# EAGLE design MineSweepers2019-Board (EAGLE 9.3.0)
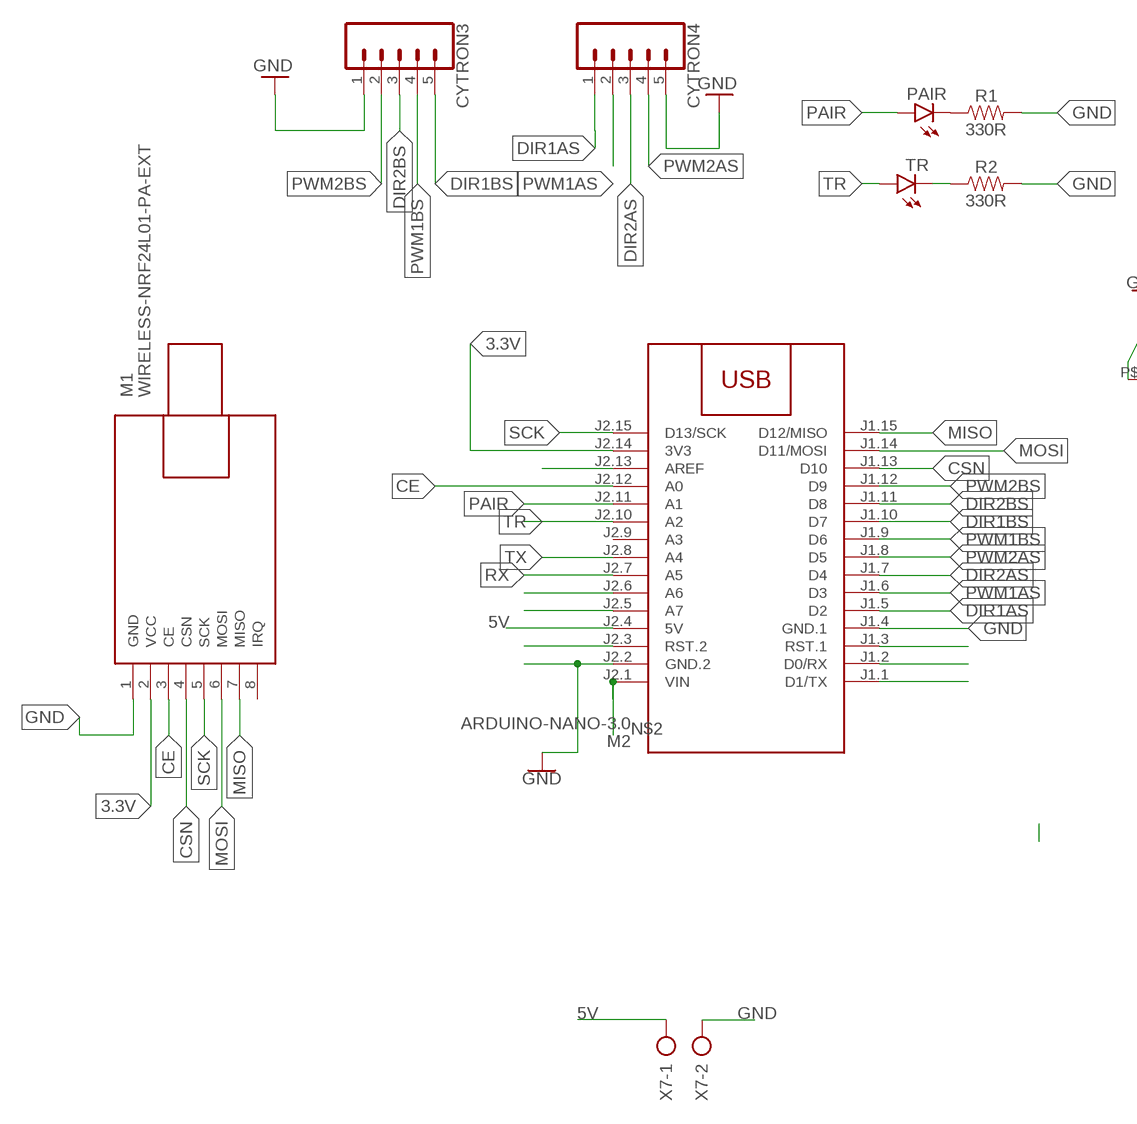
[diagram p0: schematic, sheet 1, part 1 of 2]
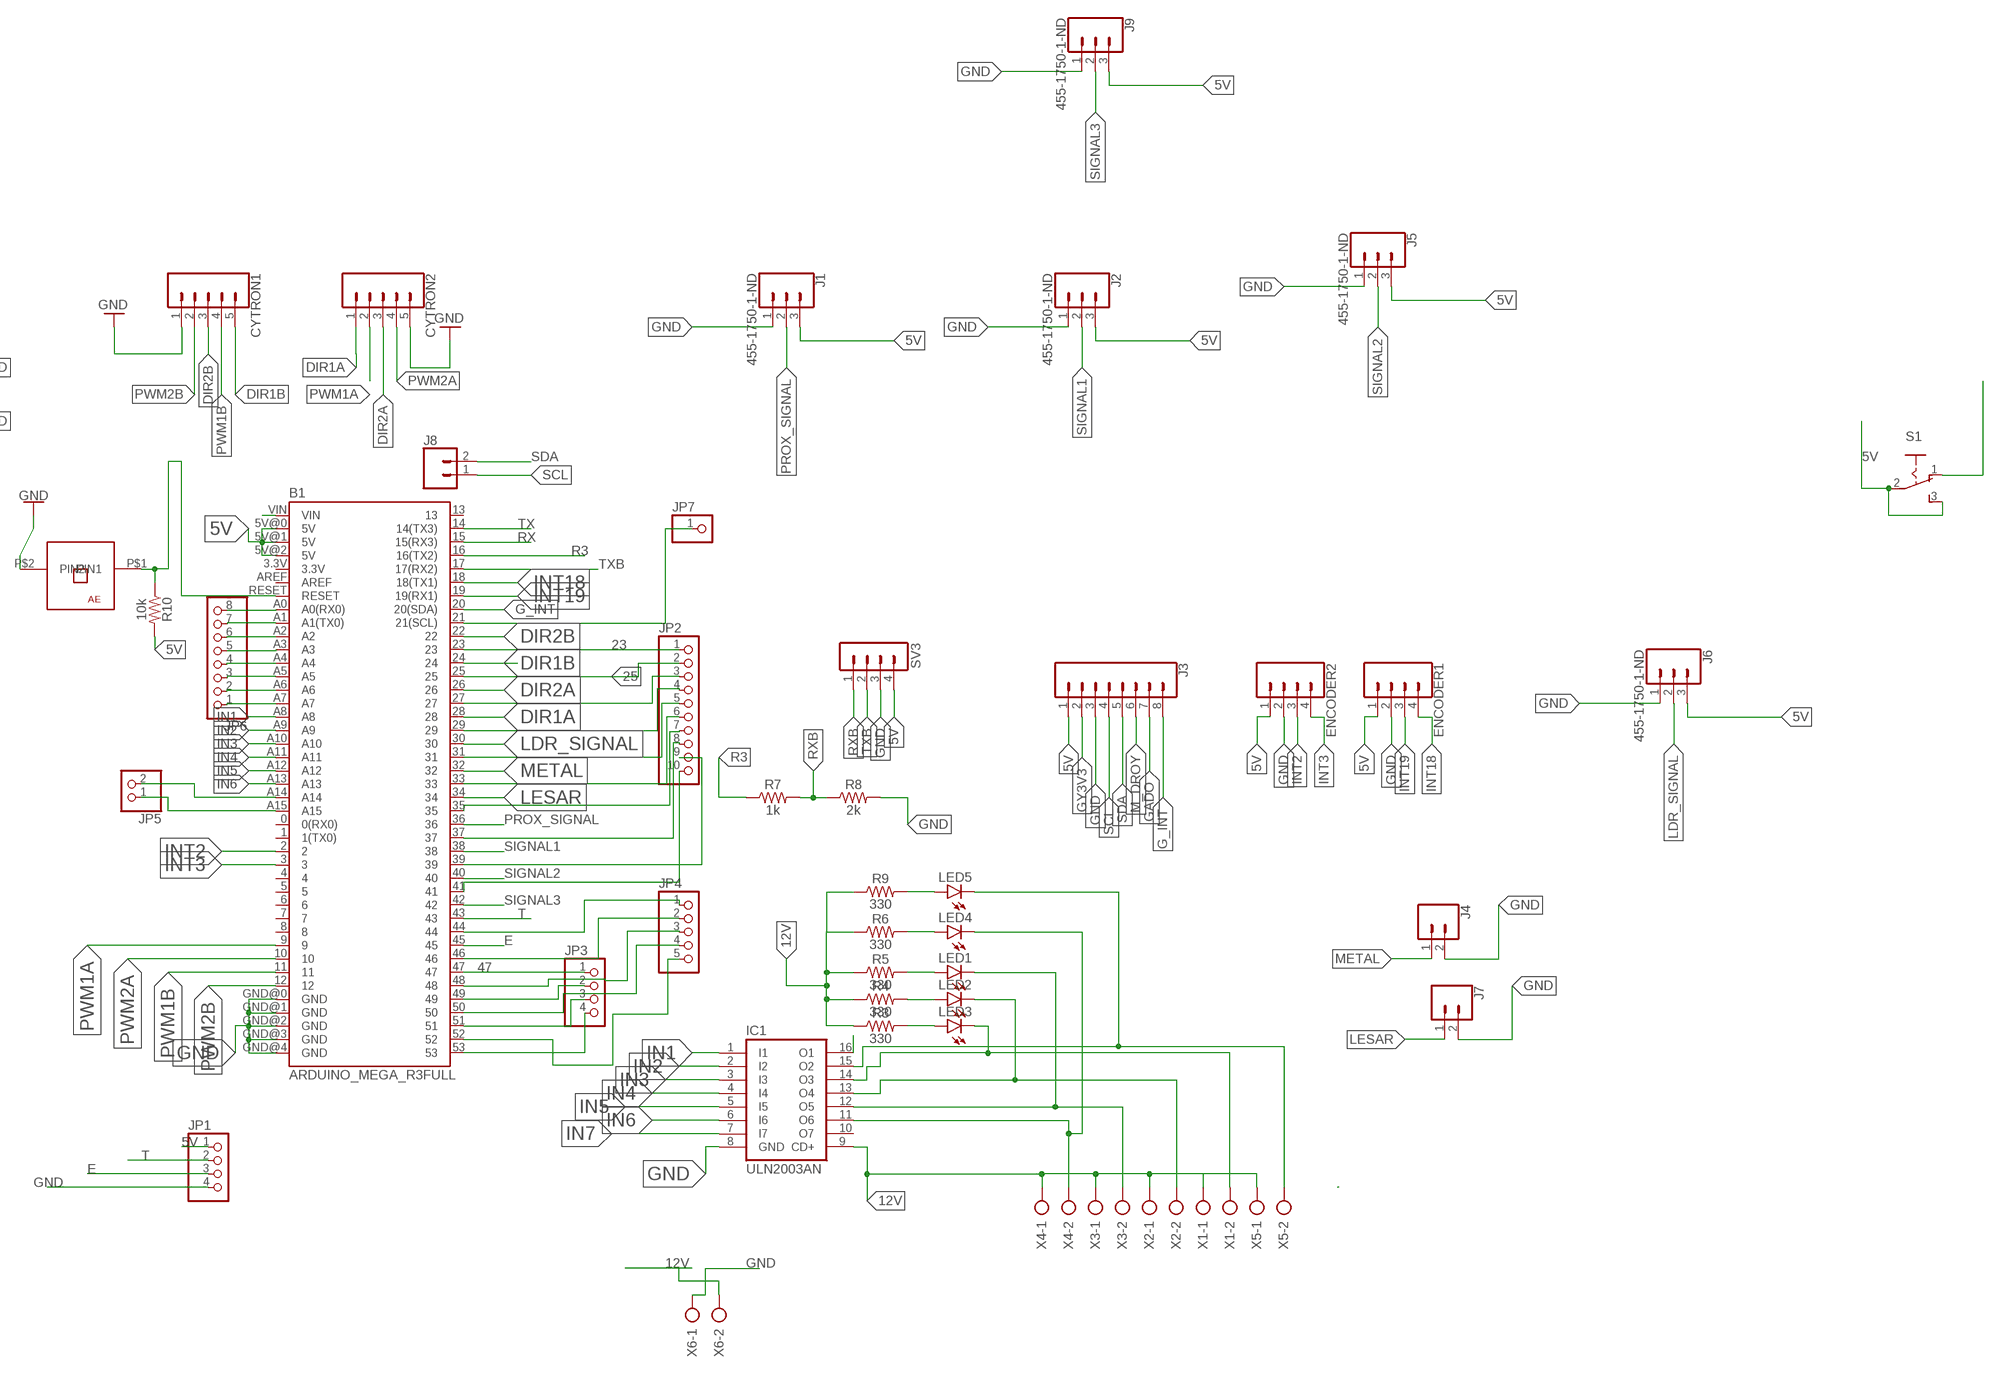
[diagram p1: schematic, sheet 1, part 2 of 2]

## Parts
B1  ARDUINO_MEGA_R3FULL  [ARDUINO_MEGA]
CYTRON1  CONN_05  [1X05]
CYTRON2  CONN_05  [1X05]
CYTRON3  CONN_05  [1X05]
CYTRON4  CONN_05  [1X05]
ENCODER1  CONN_04  [1X04]
ENCODER2  CONN_04  [1X04]
IC1  ULN2003AN  [DIL16]
J1  455-1750-1-ND  CONN_03  [1X03]
J2  455-1750-1-ND  CONN_03  [1X03]
J3  CONN_08"  [1X08]
J4  CONN_02  [1X02]
J5  455-1750-1-ND  CONN_03  [1X03]
J6  455-1750-1-ND  CONN_03  [1X03]
J7  CONN_02  [1X02]
J8  CONN_02  [1X02]
J9  455-1750-1-ND  CONN_03  [1X03]
JP1  PINHD-1X4  [1X04]
JP2  PINHD-1X10  [1X10]
JP3  PINHD-1X4  [1X04]
JP4  PINHD-1X5  [1X05]
JP5  PINHD-1X2  [1X02]
JP6  PINHD-1X8  [1X08]
JP7  PINHD-1X1  [1X01]
LED1  LED3MM  [LED3MM]
LED2  LED3MM  [LED3MM]
LED3  LED3MM  [LED3MM]
LED4  LED3MM  [LED3MM]
LED5  LED3MM  [LED3MM]
M1  WIRELESS-NRF24L01-PA-EXT  [WIRELESS-NRF24L01-PA-EXT]
M2  ARDUINO-NANO-3.0  [ARDUINO-NANO-3.0]
PAIR  LED3MM  [LED3MM]
R1  330R  10MOHM-HORIZ-1/4W-5%  [AXIAL-0.3]
R2  330R  10MOHM-HORIZ-1/4W-5%  [AXIAL-0.3]
R3  330  10MOHM-HORIZ-1/4W-5%  [AXIAL-0.3]
R4  330  10MOHM-HORIZ-1/4W-5%  [AXIAL-0.3]
R5  330  10MOHM-HORIZ-1/4W-5%  [AXIAL-0.3]
R6  330  10MOHM-HORIZ-1/4W-5%  [AXIAL-0.3]
R7  1k  10MOHM-HORIZ-1/4W-5%  [AXIAL-0.3]
R8  2k  10MOHM-HORIZ-1/4W-5%  [AXIAL-0.3]
R9  330  10MOHM-HORIZ-1/4W-5%  [AXIAL-0.3]
R10  10k  10MOHM-HORIZ-1/4W-5%  [AXIAL-0.3]
S1  255SB  [255SB]
SV3  MA04-1  [MA04-1]
TR  LED3MM  [LED3MM]
U$1  PUSHBUTTON-AE  [PUSHBUTTON-AE]
X1  AK500/2-H  [AK500/2-H]
X2  AK500/2-H  [AK500/2-H]
X3  AK500/2-H  [AK500/2-H]
X4  AK500/2-H  [AK500/2-H]
X5  AK500/2-H  [AK500/2-H]
X6  AK500/2-H  [AK500/2-H]
X7  AK500/2-H  [AK500/2-H]

## Nets
3.3V: M1.2(VCC) M2.J2.14(3V3)
5V: B1.5V@0(5V) B1.5V@1(5V) B1.5V@2(5V) ENCODER1.1 ENCODER2.1 J1.3 J2.3 J3.1 J5.3 J6.3 J9.3 JP1.1 M2.J2.4(5V) R10.P$2 S1.2(P) S1.3(S) SV3.4 X7.1
12V: IC1.9(CD+) R3.P$1 R4.P$1 R5.P$1 R6.P$1 R9.P$1 X1.1 X2.1 X3.1 X4.1 X5.1 X6.2
23: B1.23 JP2.1
25: B1.25 JP2.2
47: B1.47 JP3.1
CE: M1.3(CE) M2.J2.12(A0)
CSN: M1.4(CSN) M2.J1.13(D10)
DIR1A: B1.28 CYTRON2.1
DIR1AS: CYTRON4.1 M2.J1.5(D2)
DIR1B: B1.24 CYTRON1.5
DIR1BS: CYTRON3.5 M2.J1.10(D7)
DIR2A: B1.26 CYTRON2.3
DIR2AS: CYTRON4.3 M2.J1.7(D4)
DIR2B: B1.22 CYTRON1.3
DIR2BS: CYTRON3.3 M2.J1.11(D8)
E: B1.45 JP1.3
G_INT: B1.20(20(SDA)) J3.8
GADO: J3.7
GND: B1.GND@0(GND) B1.GND@1(GND) B1.GND@2(GND) B1.GND@3(GND) B1.GND@4(GND) CYTRON1.1 CYTRON2.5 CYTRON3.1 CYTRON4.5 ENCODER1.2 ENCODER2.2 IC1.8(GND) J1.1 J2.1 J3.3 J4.2 J5.1 J6.1 J7.2 J9.1 JP1.4 M1.1(GND) M2.J1.4(GND.1) M2.J2.2(GND.2) R1.P$2 R2.P$2 R8.P$2 SV3.3 U$1.P$2(PIN2) X6.1 X7.2
GY3V3: J3.2
IN1: B1.A8 IC1.1(I1)
IN2: B1.A9 IC1.2(I2)
IN3: B1.A10 IC1.3(I3)
IN4: B1.A11 IC1.4(I4)
IN5: B1.A12 IC1.5(I5)
IN6: B1.A13 IC1.6(I6)
IN7: IC1.7(I7)
INT2: B1.2 ENCODER2.3
INT3: B1.3 ENCODER2.4
INT18: B1.18(18(TX1)) ENCODER1.4
INT19: B1.19(19(RX1)) ENCODER1.3
LDR_SIGNAL: B1.30 J6.2
LESAR: B1.34 J7.1
M_DROY: J3.6
METAL: B1.32 J4.1
MISO: M1.7(MISO) M2.J1.15(D12/MISO)
MOSI: M1.6(MOSI) M2.J1.14(D11/MOSI)
N$1: M2.J1.3(RST.1)
N$2: M2.J2.1(VIN)
N$3: LED5.A R9.P$2
N$4: S1.1(O)
N$5: PAIR.K(C) R1.P$1
N$6: M2.J2.13(AREF)
N$7: R2.P$1 TR.K(C)
N$10: B1.27 JP2.3
N$11: IC1.13(O4) LED2.K(C) X2.2
N$12: IC1.14(O3) LED3.K(C) X1.2
N$13: M2.J2.6(A6)
N$14: M2.J2.5(A7)
N$15: IC1.12(O5) LED1.K(C) X3.2
N$16: M2.J2.3(RST.2)
N$17: B1.29 JP2.4
N$18: B1.31 JP2.5
N$19: B1.33 JP2.6
N$20: B1.35 JP2.7
N$21: LED3.A R3.P$2
N$22: LED2.A R4.P$2
N$23: B1.37 JP2.8
N$24: LED1.A R5.P$2
N$25: M2.J1.2(D0/RX)
N$26: M2.J1.1(D1/TX)
N$27: B1.39 JP2.9
N$28: B1.41 JP2.10
N$29: B1.49 JP3.2
N$30: B1.51 JP3.3
N$31: LED4.A R6.P$2
N$32: B1.53 JP3.4
N$33: B1.44 JP4.1
N$34: B1.46 JP4.2
N$35: B1.48 JP4.3
N$36: B1.50 JP4.4
N$37: B1.52 JP4.5
N$38: B1.A1(A1(TX0)) JP6.7
N$39: B1.A2 JP6.6
N$40: B1.A3 JP6.5
N$41: B1.A4 JP6.4
N$42: B1.A5 JP6.3
N$43: B1.A6 JP6.2
N$44: B1.A7 JP6.1
N$45: B1.A0(A0(RX0)) JP6.8
N$46: B1.A14 JP5.2
N$47: B1.A15 JP5.1
N$48: B1.21(21(SCL)) JP7.1
N$50: B1.RESET R10.P$1 U$1.P$1(PIN1)
O1: IC1.15(O2) LED5.K(C) X5.2
O2: IC1.16(O1)
O6: IC1.11(O6) LED4.K(C) X4.2
PAIR: M2.J2.11(A1) PAIR.A
PROX_SIGNAL: B1.36 J1.2
PWM1A: B1.9 CYTRON2.2
PWM1AS: CYTRON4.2 M2.J1.6(D3)
PWM1B: B1.11 CYTRON1.4
PWM1BS: CYTRON3.4 M2.J1.9(D6)
PWM2A: B1.10 CYTRON2.4
PWM2AS: CYTRON4.4 M2.J1.8(D5)
PWM2B: B1.12 CYTRON1.2
PWM2BS: CYTRON3.2 M2.J1.12(D9)
R3: B1.16(16(TX2)) R7.P$1
RX: B1.15(15(RX3)) M2.J2.7(A5)
RXB: R7.P$2 R8.P$1 SV3.1
SCK: M1.5(SCK) M2.J2.15(D13/SCK)
SCL: J3.4 J8.1
SDA: J3.5 J8.2
SIGNAL1: B1.38 J2.2
SIGNAL2: B1.40 J5.2
SIGNAL3: B1.42 J9.2
T: B1.43 JP1.2
TR: M2.J2.10(A2) TR.A
TX: B1.14(14(TX3)) M2.J2.8(A4)
TXB: B1.17(17(RX2)) SV3.2
VIN: B1.VIN
Unconnected: B1.0(0(RX0)) B1.1(1(TX0)) B1.3.3V B1.4 B1.5 B1.6 B1.7 B1.8 B1.13 B1.AREF IC1.10(O7) M1.8(IRQ) M2.J2.9(A3)

## Library data of the parts
B1 = SparkFun-Boards:ARDUINO_MEGA_R3: Arduino Mega R3 ATmega2560 R3 compatible footprint. SparkFun Products: Arduino Mega 2560 R3 <https://www.sparkfun.com/products/11061>
CYTRON1-CYTRON4 = SparkFun-Connectors:CONN_05: Multi connection point. Often used as Generic Header-pin footprint for 0.1 inch spaced/style header connections On any of the 0.1 inch spaced packages, you can populate with these: Break Away Headers - Straight <https://www.sparkfun.com/products/116> (PRT-00116) Break Away Male Headers - Right Angle <https://www.sparkfun.com/products/553> (PRT-00553) Female Headers <https://www.sparkfun.com/products/115> (PRT-00115) Break Away Headers - Machine Pin <https://www.sparkfun.com/products/117> (PRT-00117) Break Away Female Headers - Swiss Machine Pin <https://www.sparkfun.com/products/743> (PRT-00743) For SCREWTERMINALS and SPRING TERMINALS visit here: Screw Terimnals on SparkFun.com <https://www.sparkfun.com/search/results?term=Screw+Terminals> (5mm/3.5mm/2.54mm spacing) This device is also useful as a general connection point to wire up your design to another part of your project. Our various solder wires solder well into these plated through hole pads. Hook-Up Wire - Assortment (Stranded, 22 AWG) <https://www.sparkfun.com/products/11375> (PRT-11375) Hook-Up Wire - Assortment (Solid Core, 22 AWG) <https://www.sparkfun.com/products/11367> (PRT-11367) View the entire wire category on our website here <https://www.sparkfun.com/categories/141> Special notes: Molex polarized connector foot print use with SKU : PRT-08231 with associated crimp pins and housings. 1MM SMD Version SKU: PRT-10208
ENCODER1 ENCODER2 = SparkFun-Connectors:CONN_04: Multi connection point. Often used as Generic Header-pin footprint for 0.1 inch spaced/style header connections On any of the 0.1 inch spaced packages, you can populate with these: Break Away Headers - Straight <https://www.sparkfun.com/products/116> (PRT-00116) Break Away Male Headers - Right Angle <https://www.sparkfun.com/products/553> (PRT-00553) Female Headers <https://www.sparkfun.com/products/115> (PRT-00115) Break Away Headers - Machine Pin <https://www.sparkfun.com/products/117> (PRT-00117) Break Away Female Headers - Swiss Machine Pin <https://www.sparkfun.com/products/743> (PRT-00743) For SCREWTERMINALS and SPRING TERMINALS visit here: Screw Terimnals on SparkFun.com <https://www.sparkfun.com/search/results?term=Screw+Terminals> (5mm/3.5mm/2.54mm spacing) This device is also useful as a general connection point to wire up your design to another part of your project. Our various solder wires solder well into these plated through hole pads. Hook-Up Wire - Assortment (Stranded, 22 AWG) <https://www.sparkfun.com/products/11375> (PRT-11375) Hook-Up Wire - Assortment (Solid Core, 22 AWG) <https://www.sparkfun.com/products/11367> (PRT-11367) View the entire wire category on our website here <https://www.sparkfun.com/categories/141> Special notes: Molex polarized connector foot print use with SKU : PRT-08231 with associated crimp pins and housings. 1MM SMD Version SKU: PRT-10208; PROD_ID: CONN-09696
IC1 = uln-udn:ULN2003A: DRIVER ARRAY
J1 J2 J5 J6 J9 = SparkFun-Connectors:CONN_03: Multi connection point. Often used as Generic Header-pin footprint for 0.1 inch spaced/style header connections On any of the 0.1 inch spaced packages, you can populate with these: Break Away Headers - Straight <https://www.sparkfun.com/products/116> (PRT-00116) Break Away Male Headers - Right Angle <https://www.sparkfun.com/products/553> (PRT-00553) Female Headers <https://www.sparkfun.com/products/115> (PRT-00115) Break Away Headers - Machine Pin <https://www.sparkfun.com/products/117> (PRT-00117) Break Away Female Headers - Swiss Machine Pin <https://www.sparkfun.com/products/743> (PRT-00743) Stackable Header - 3 Pin (Female, 0.1") <https://www.sparkfun.com/products/13875> (PRT-13875) For SCREWTERMINALS and SPRING TERMINALS visit here: Screw Terimnals on SparkFun.com <https://www.sparkfun.com/search/results?term=Screw+Terminals> (5mm/3.5mm/2.54mm spacing) This device is also useful as a general connection point to wire up your design to another part of your project. Our various solder wires solder well into these plated through hole pads. Hook-Up Wire - Assortment (Stranded, 22 AWG) <https://www.sparkfun.com/products/11375> (PRT-11375) Hook-Up Wire - Assortment (Solid Core, 22 AWG) <https://www.sparkfun.com/products/11367> (PRT-11367) View the entire wire category on our website here <https://www.sparkfun.com/categories/141> Special notes: Molex polarized connector foot print use with SKU : PRT-08232 with associated crimp pins and housings.; PROD_ID: XXX-00000
J3 = SparkFun-Connectors:CONN_08: Multi connection point. Often used as Generic Header-pin footprint for 0.1 inch spaced/style header connections On any of the 0.1 inch spaced packages, you can populate with these: Break Away Headers - Straight <https://www.sparkfun.com/products/116> (PRT-00116) Break Away Male Headers - Right Angle <https://www.sparkfun.com/products/553> (PRT-00553) Female Headers <https://www.sparkfun.com/products/115> (PRT-00115) Break Away Headers - Machine Pin <https://www.sparkfun.com/products/117> (PRT-00117) Break Away Female Headers - Swiss Machine Pin <https://www.sparkfun.com/products/743> (PRT-00743) Arduino Stackable Header - 8 Pin <https://www.sparkfun.com/products/9279> (PRT-09279) For SCREWTERMINALS and SPRING TERMINALS visit here: Screw Terimnals on SparkFun.com <https://www.sparkfun.com/search/results?term=Screw+Terminals> (5mm/3.5mm/2.54mm spacing) This device is also useful as a general connection point to wire up your design to another part of your project. Our various solder wires solder well into these plated through hole pads. Hook-Up Wire - Assortment (Stranded, 22 AWG) <https://www.sparkfun.com/products/11375> (PRT-11375) Hook-Up Wire - Assortment (Solid Core, 22 AWG) <https://www.sparkfun.com/products/11367> (PRT-11367) View the entire wire category on our website here <https://www.sparkfun.com/categories/141> Special notes: Molex polarized connector foot print use with SKU : PRT-08231 with associated crimp pins and housings. 1MM SMD Version SKU: PRT-10208 NOTES ON THE VARIANTS LOCK and LOCK_LONGPADS... This footprint was designed to help hold the alignment of a through-hole component (i.e. 6-pin header) while soldering it into place. You may notice that each hole has been shifted either up or down by 0.005 of an inch from it's more standard position (which is a perfectly straight line). This slight alteration caused the pins (the squares in the middle) to touch the edges of the holes. Because they are alternating, it causes a "brace" to hold the component in place. 0.005 has proven to be the perfect amount of "off-center" position when using our standard breakaway headers. Although looks a little odd when you look at the bare footprint, once you have a header in there, the alteration is very hard to notice. Also,if you push a header all the way into place, it is covered up entirely on the bottom side.; PROD_ID: CONN-08438
J4 J7 J8 = SparkFun-Connectors:CONN_02: Multi connection point. Often used as Generic Header-pin footprint for 0.1 inch spaced/style header connections On any of the 0.1 inch spaced packages, you can populate with these: Break Away Headers - Straight <https://www.sparkfun.com/products/116> (PRT-00116) Break Away Male Headers - Right Angle <https://www.sparkfun.com/products/553> (PRT-00553) Female Headers <https://www.sparkfun.com/products/115> (PRT-00115) Break Away Headers - Machine Pin <https://www.sparkfun.com/products/117> (PRT-00117) Break Away Female Headers - Swiss Machine Pin <https://www.sparkfun.com/products/743> (PRT-00743) For SCREWTERMINALS and SPRING TERMINALS visit here: Screw Terimnals on SparkFun.com <https://www.sparkfun.com/search/results?term=Screw+Terminals> (5mm/3.5mm/2.54mm spacing) This device is also useful as a general connection point to wire up your design to another part of your project. Our various solder wires solder well into these plated through hole pads. Hook-Up Wire - Assortment (Stranded, 22 AWG) <https://www.sparkfun.com/products/11375> (PRT-11375) Hook-Up Wire - Assortment (Solid Core, 22 AWG) <https://www.sparkfun.com/products/11367> (PRT-11367) View the entire wire category on our website here <https://www.sparkfun.com/categories/141> Special notes: Molex polarized connector foot print use with: PRT-08233 with associated crimp pins and housings. 2.54_SCREWTERM for use with PRT-10571. 3.5mm Screw Terminal footprints for PRT-08084 5mm Screw Terminal footprints for use with PRT-08432
JP1 JP3 = pinhead:PINHD-1X4: PIN HEADER
JP2 = pinhead:PINHD-1X10: PIN HEADER
JP4 = pinhead:PINHD-1X5: PIN HEADER
JP5 = pinhead:PINHD-1X2: PIN HEADER
JP6 = pinhead:PINHD-1X8: PIN HEADER
JP7 = pinhead:PINHD-1X1: PIN HEADER
LED1-LED5 PAIR TR = led:LED: LED OSRAM: - CHIPLED LG R971, LG N971, LY N971, LG Q971, LY Q971, LO R971, LY R971 LH N974, LH R974 LS Q976, LO Q976, LY Q976 LO Q996 - Hyper CHIPLED LW Q18S LB Q993, LB Q99A, LB R99A - SideLED LS A670, LO A670, LY A670, LG A670, LP A670 LB A673, LV A673, LT A673, LW A673 LH A674 LY A675 LS A676, LA A676, LO A676, LY A676, LW A676 LS A679, LY A679, LG A679 - Hyper Micro SIDELED® LS Y876, LA Y876, LO Y876, LY Y876 LT Y87S - SmartLED LW L88C, LW L88S LB L89C, LB L89S, LG L890 LS L89K, LO L89K, LY L89K LS L896, LA L896, LO L896, LY L896 - TOPLED LS T670, LO T670, LY T670, LG T670, LP T670 LSG T670, LSP T670, LSY T670, LOP T670, LYG T670 LG T671, LOG T671, LSG T671 LB T673, LV T673, LT T673, LW T673 LH T674 LS T676, LA T676, LO T676, LY T676, LB T676, LH T676, LSB T676, LW T676 LB T67C, LV T67C, LT T67C, LS T67K, LO T67K, LY T67K, LW E67C LS E67B, LA E67B, LO E67B, LY E67B, LB E67C, LV E67C, LT E67C LW T67C LS T679, LY T679, LG T679 LS T770, LO T770, LY T770, LG T770, LP T770 LB T773, LV T773, LT T773, LW T773 LH T774 LS E675, LA E675, LY E675, LS T675 LS T776, LA T776, LO T776, LY T776, LB T776 LHGB T686 LT T68C, LB T68C - Hyper Mini TOPLED® LB M676 - Mini TOPLED Santana® LG M470 LS M47K, LO M47K, LY M47K Source: http://www.osram.convergy.de LUXEON: - LUMILED® LXK2-PW12-R00, LXK2-PW12-S00, LXK2-PW14-U00, LXK2-PW14-V00 LXK2-PM12-R00, LXK2-PM12-S00, LXK2-PM14-U00 LXK2-PE12-Q00, LXK2-PE12-R00, LXK2-PE12-S00, LXK2-PE14-T00, LXK2-PE14-U00 LXK2-PB12-K00, LXK2-PB12-L00, LXK2-PB12-M00, LXK2-PB14-N00, LXK2-PB14-P00, LXK2-PB14-Q00 LXK2-PR12-L00, LXK2-PR12-M00, LXK2-PR14-Q00, LXK2-PR14-R00 LXK2-PD12-Q00, LXK2-PD12-R00, LXK2-PD12-S00 LXK2-PH12-R00, LXK2-PH12-S00 LXK2-PL12-P00, LXK2-PL12-Q00, LXK2-PL12-R00 Source: www.luxeon.com KINGBRIGHT: KA-3528ASYC Source: www.kingbright.com
M1 = diy-modules:WIRELESS-NRF24L01-PA-EXT: 2.4 GHz Wireless Module based on NRF24L01 chip with preamplifier and external antenna Click here to find device on ebay.com <http://www.ebay.com/sch/nrf24l01+pa+lna+sma>
M2 = diy-modules:ARDUINO-NANO-3.0: Arduino Nano 3.0 and compatible devices More details available here: https://www.arduino.cc/en/Main/ArduinoBoardNano Click here to find device on ebay.com <http://www.ebay.com/sch/arduino+nano>
R1-R10 = SparkFun-Resistors:10MOHM: RES-09327; PROD_ID: RES-09327; VALUE: 10M
S1 = switch:255SB: SLIDING SWITCH Distributor Buerklin, 11G810
SV3 = con-lstb:MA04-1: PIN HEADER; OC_FARNELL: unknown; OC_NEWARK: unknown
U$1 = PushButton-AE:PUSHBUTTON-AE: This is 2 pin push button designed by the one and only Alaa Essam وماعندناش داتا شيت ان كان عاجبك
X1-X7 = con-ptr500:AK500/2-H: CONNECTOR Aug. 2004 / PTR Meßtechnik: Die Bezeichnung der Serie AK505 wurde geändert. Es handelt sich hierbei um AK500 in horizontaler Ausführung.; OC_FARNELL: unknown; OC_NEWARK: unknown

## Board
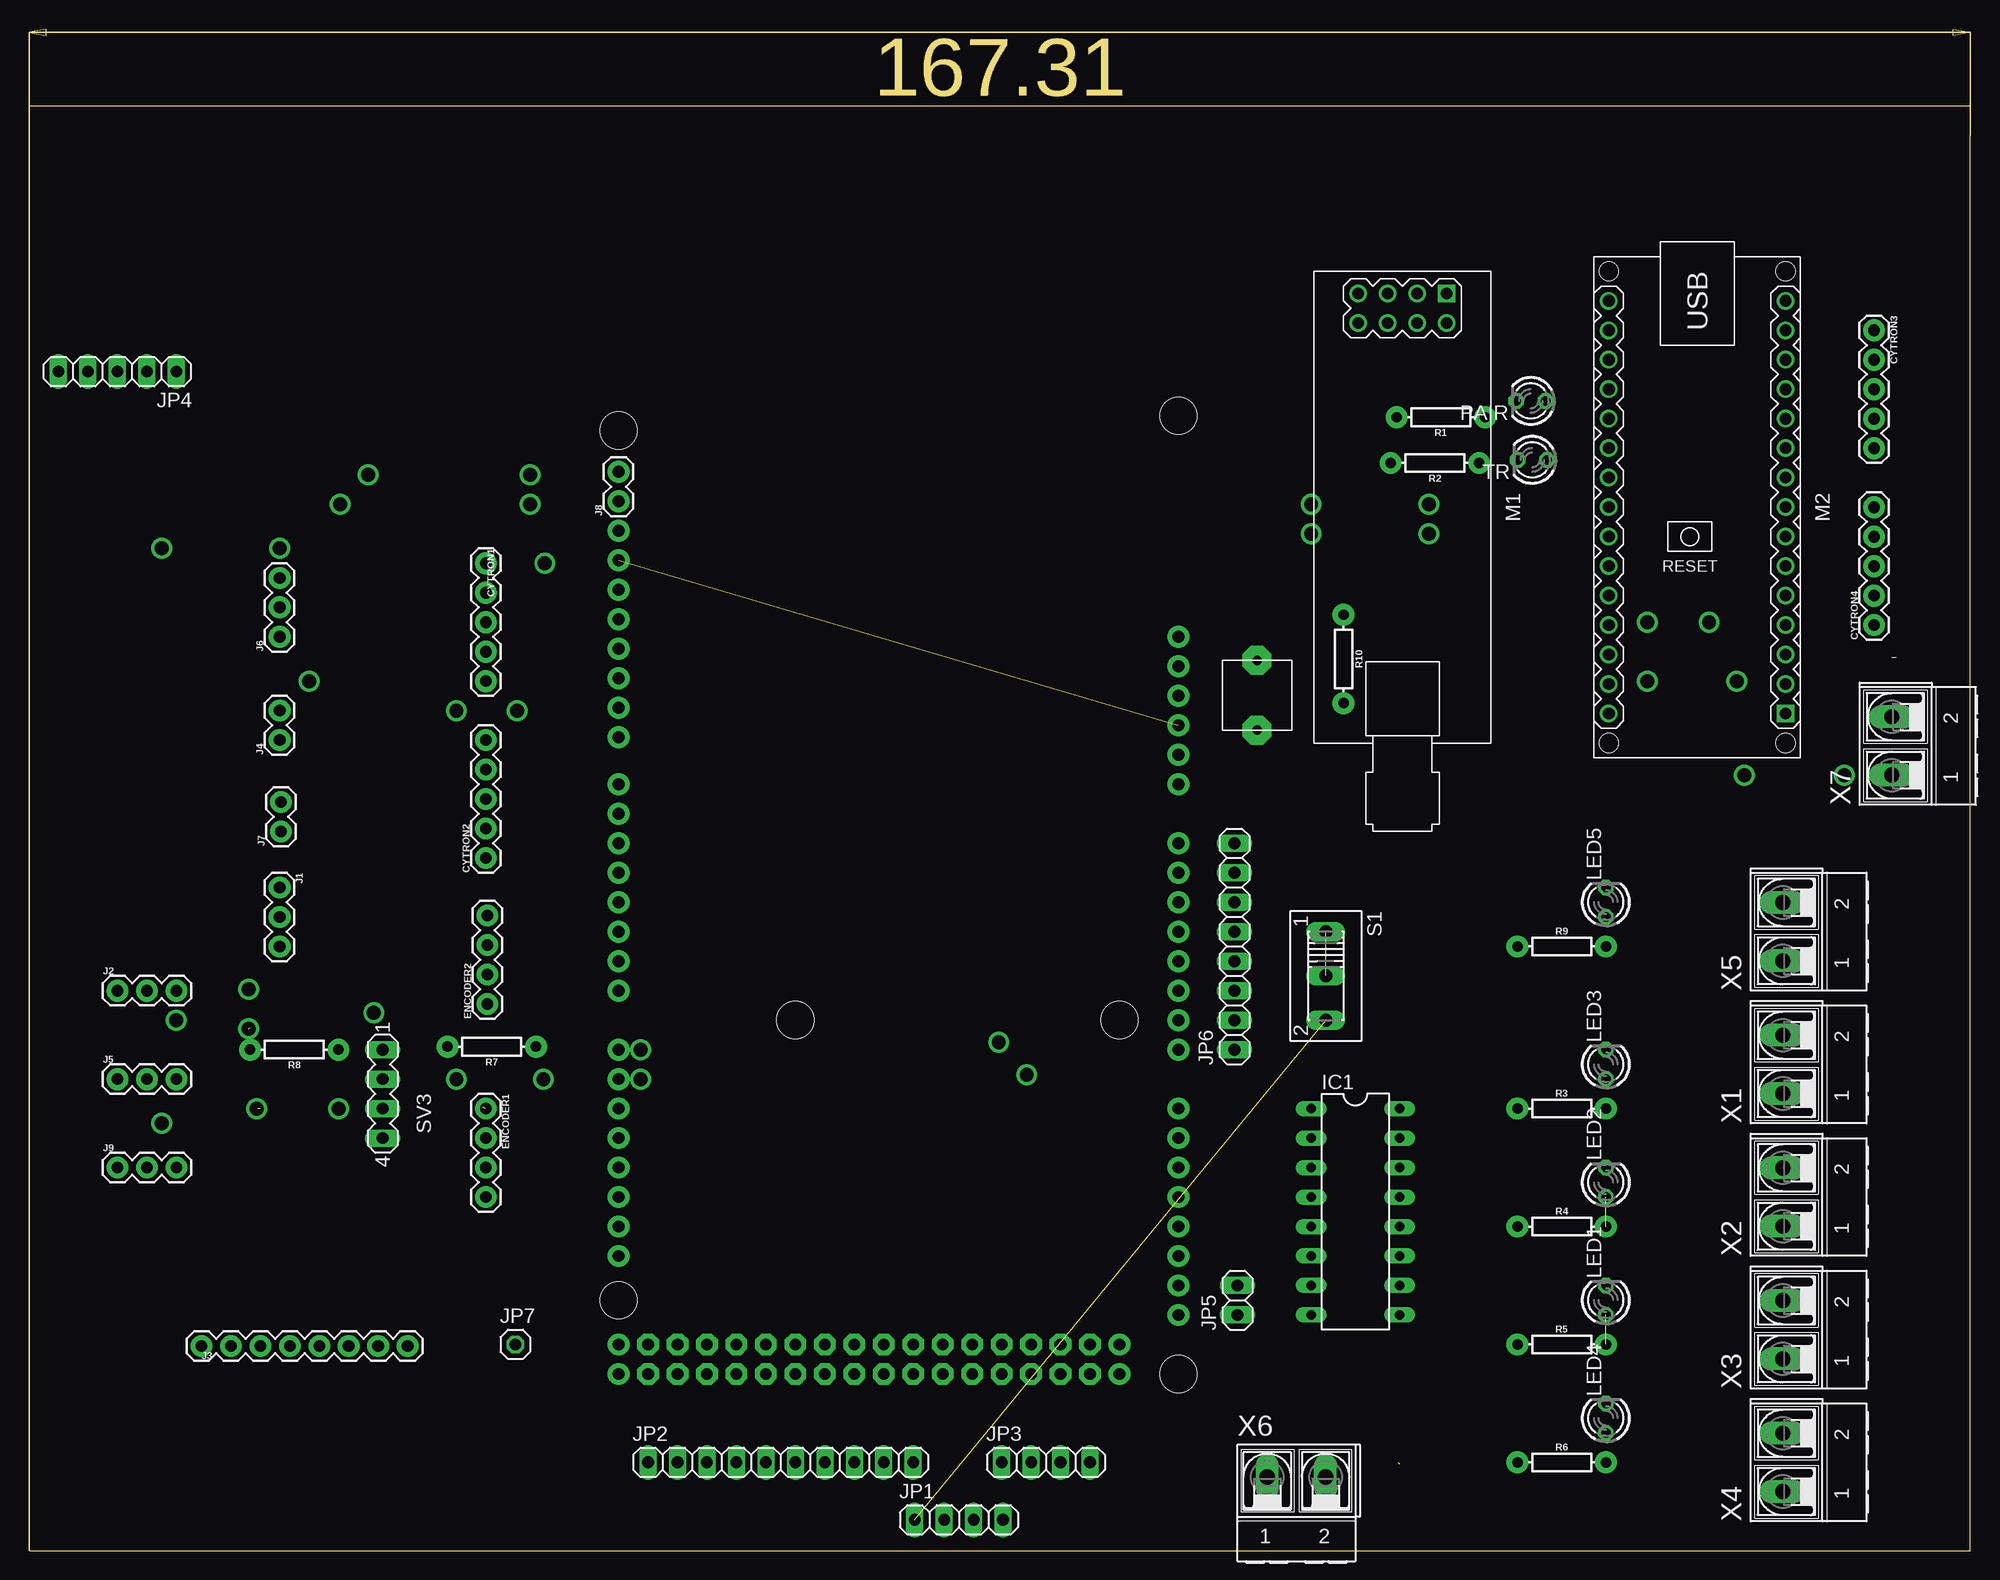
[diagram p2: board, top side]
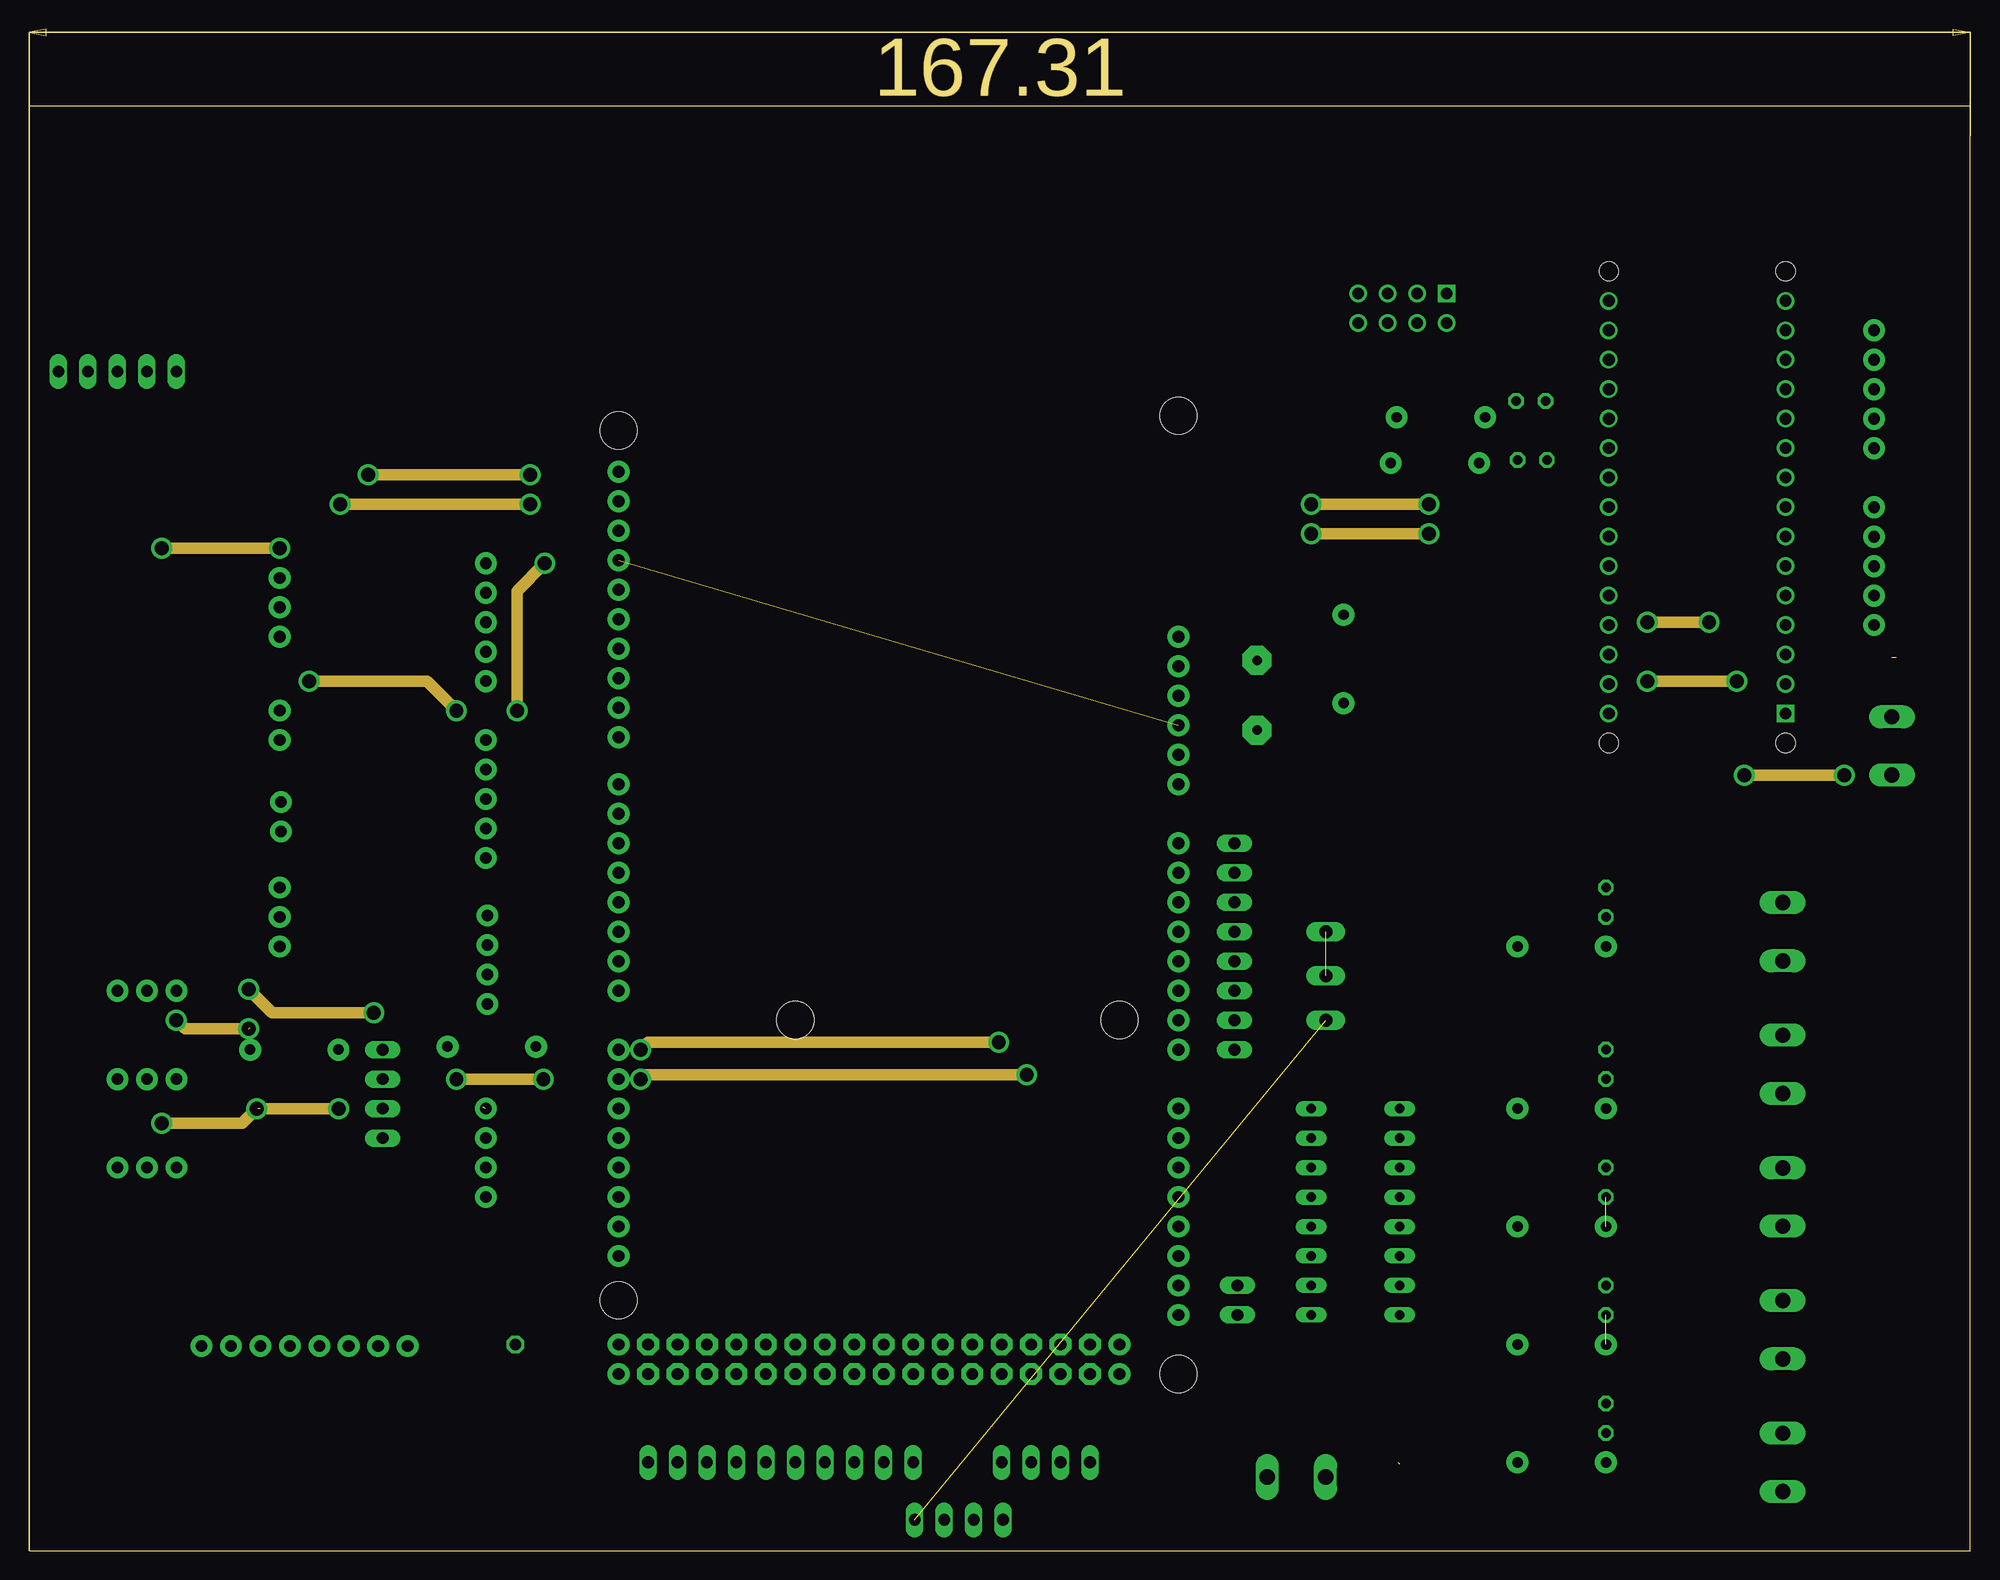
[diagram p3: board, inner layer Route14]
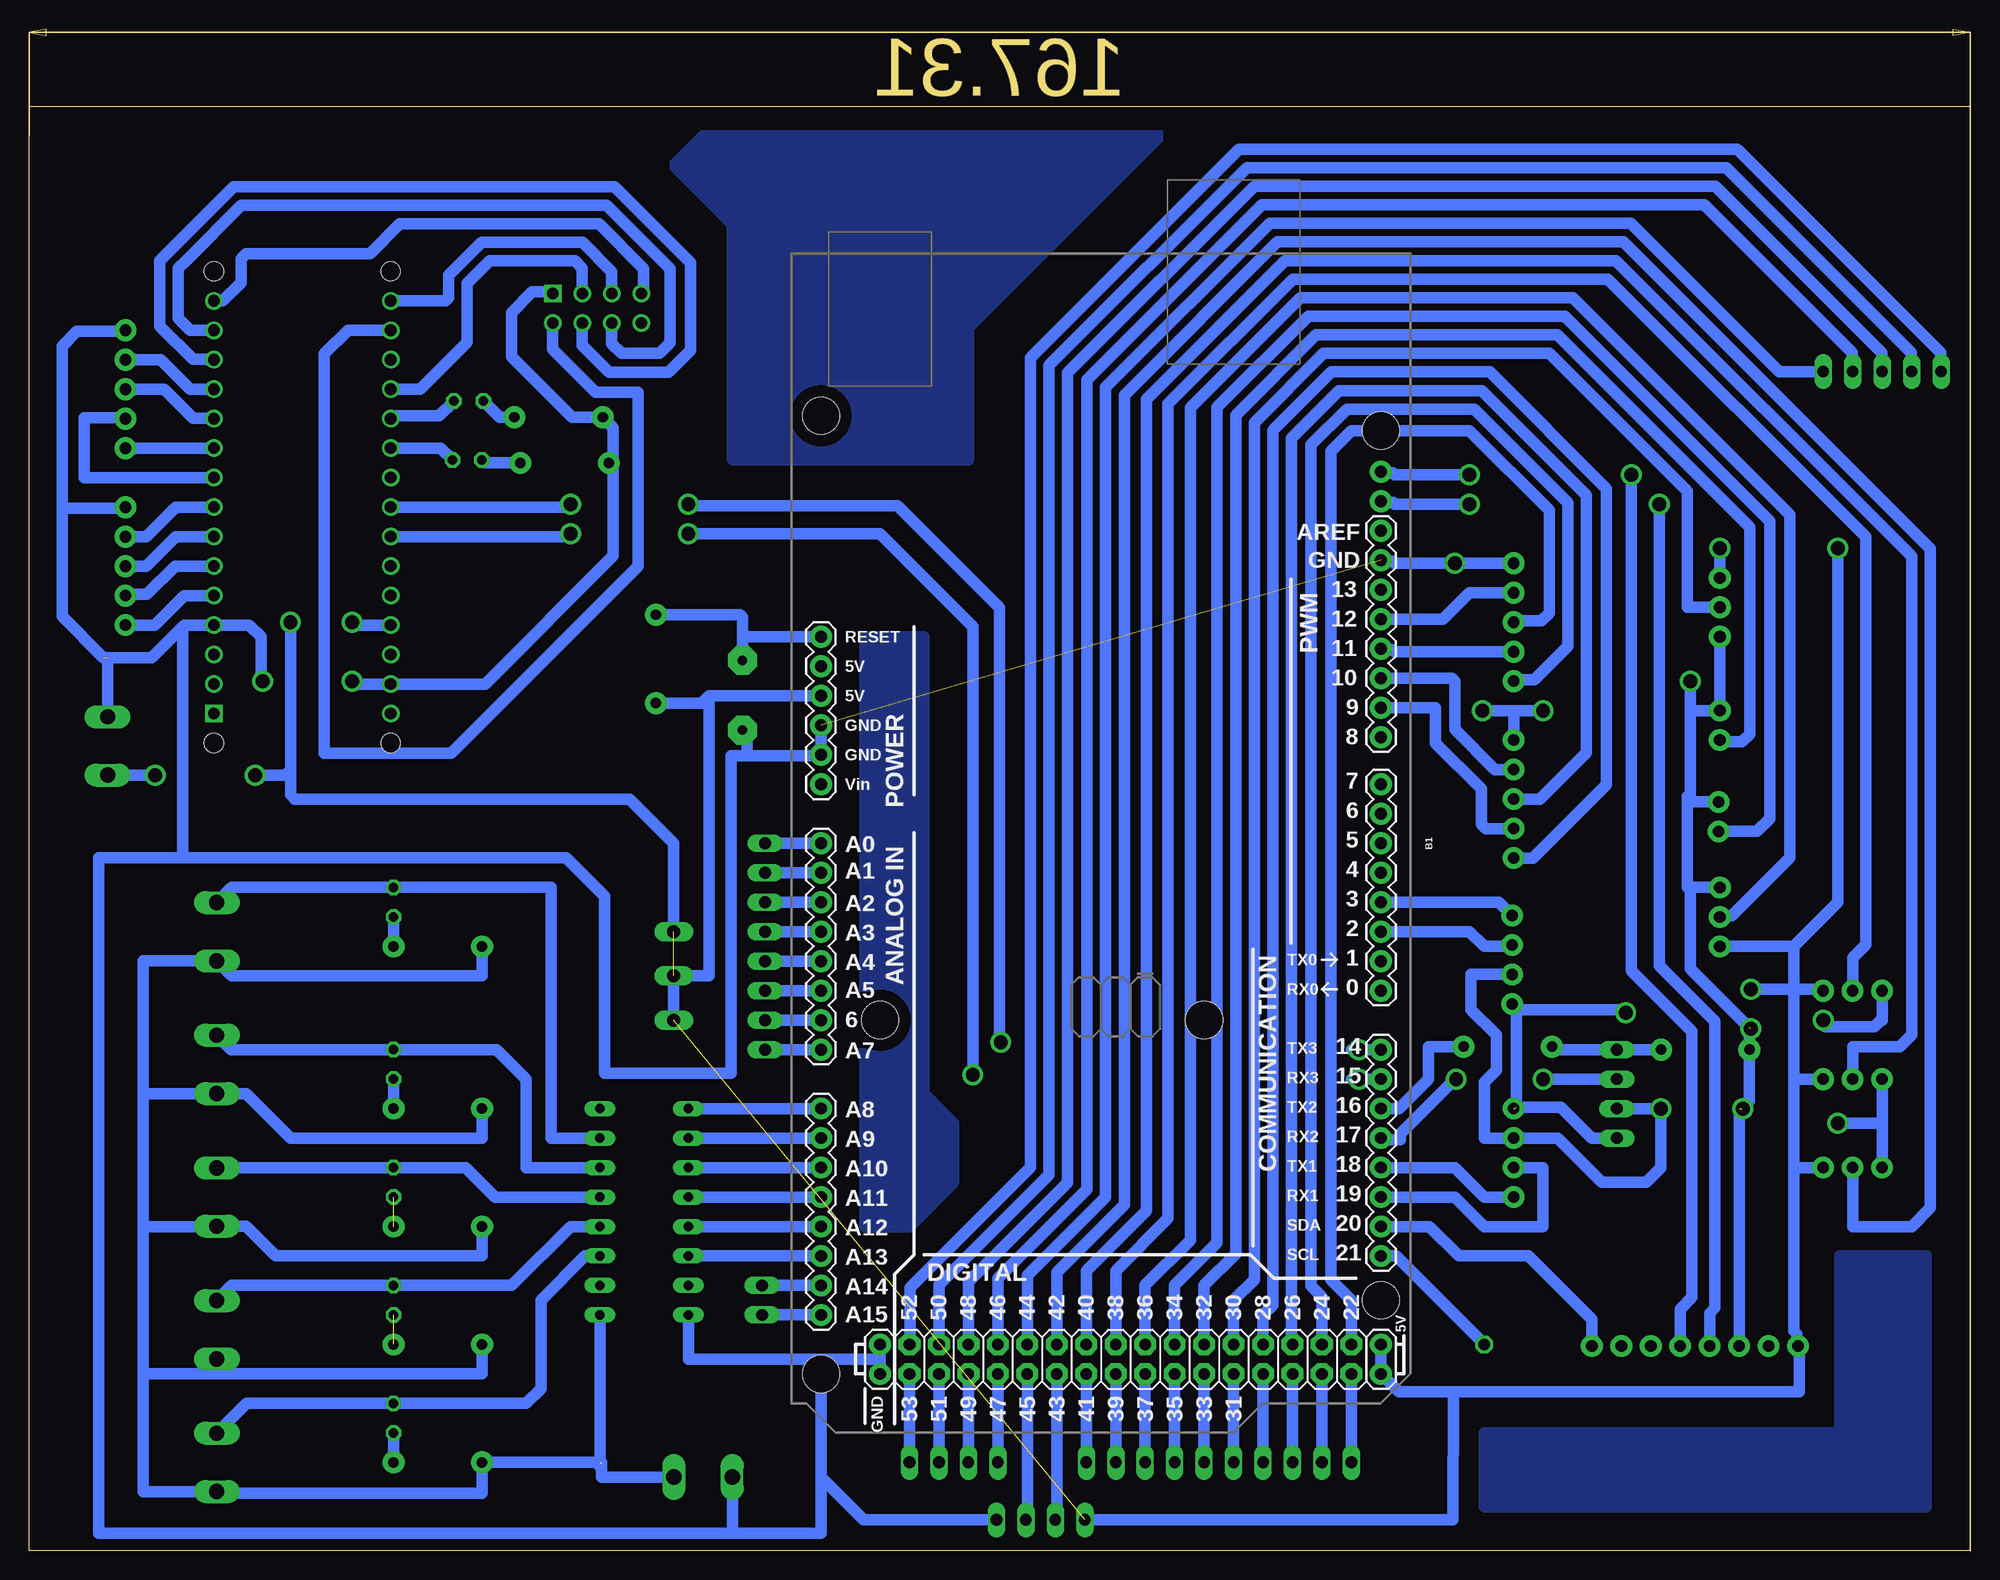
[diagram p4: board, bottom side, seen from below]

Size 167.31 x 124.45 mm. Coordinates in mm from the lower left corner, seen from the top.
Outline: 0,0 167.31,0 167.31,124.45 0,124.45 0,0
Copper layers (1*16): Top 0.035mm / dielectric 1.5mm / Bottom 0.035mm
Design rules "default *": minimum track width 1mm, minimum drill 0.35mm, track to track 0.6mm, track to pad 1mm, pad to pad 6mil, via to via 6mil, smd to smd 6mil, copper to edge 40mil, drill to drill 6mil, minimum pad ring 10mil, minimum via ring 8mil, stop-mask expansion 4mil, vias tented up to drill 0mil, thermal gap 10mil

### Footprints (pad centres in the part's own frame; a part is rotated, then mirrored left to right if it is on the bottom)
ARDUINO_MEGA = drill 1.016 pad 1.88: 0 13.97,24.13; 1 11.43,24.13; 2 8.89,24.13; 3 6.35,24.13; 3.3V -13.97,-24.13; 4 3.81,24.13; 5 1.27,24.13; 5V@0 -11.43,-24.13; 5V@1 44.45,24.13; 5V@2 46.99,24.13; 6 -1.27,24.13; 7 -3.81,24.13; 8 -7.874,24.13; 9 -10.414,24.13; 10 -12.954,24.13; 11 -15.494,24.13; 12 -18.034,24.13; 13 -20.574,24.13; 14 19.05,24.13; 15 21.59,24.13; 16 24.13,24.13; 17 26.67,24.13; 18 29.21,24.13; 19 31.75,24.13; 20 34.29,24.13; 21 36.83,24.13; A0 1.27,-24.13; A1 3.81,-24.13; A2 6.35,-24.13; A3 8.89,-24.13; A4 11.43,-24.13; A5 13.97,-24.13; A6 16.51,-24.13; A7 19.05,-24.13; A8 24.13,-24.13; A9 26.67,-24.13; A10 29.21,-24.13; A11 31.75,-24.13; A12 34.29,-24.13; A13 36.83,-24.13; A14 39.37,-24.13; A15 41.91,-24.13; AREF -25.654,24.13; GND@0 -8.89,-24.13; GND@1 -6.35,-24.13; GND@2 44.45,-19.05; GND@3 46.99,-19.05; GND@4 -23.114,24.13; RESET -16.51,-24.13; VIN -3.81,-24.13 | drill 1.016 pad 1.88 octagon: 22 44.45,21.59; 23 46.99,21.59; 24 44.45,19.05; 25 46.99,19.05; 26 44.45,16.51; 27 46.99,16.51; 28 44.45,13.97; 29 46.99,13.97; 30 44.45,11.43; 31 46.99,11.43; 32 44.45,8.89; 33 46.99,8.89; 34 44.45,6.35; 35 46.99,6.35; 36 44.45,3.81; 37 46.99,3.81; 38 44.45,1.27; 39 46.99,1.27; 40 44.45,-1.27; 41 46.99,-1.27; 42 44.45,-3.81; 43 46.99,-3.81; 44 44.45,-6.35; 45 46.99,-6.35; 46 44.45,-8.89; 47 46.99,-8.89; 48 44.45,-11.43; 49 46.99,-11.43; 50 44.45,-13.97; 51 46.99,-13.97; 52 44.45,-16.51; 53 46.99,-16.51 | hole 3.2: -34.29,24.13; -35.56,-24.13; 16.51,8.89; 16.51,-19.05; 40.64,24.13; 46.99,-24.13
1X05 = drill 1.016 pad 1.88: 1 0,0; 2 2.54,0; 3 5.08,0; 4 7.62,0; 5 10.16,0
1X04 = drill 1.016 pad 1.88: 1 0,0; 2 2.54,0; 3 5.08,0; 4 7.62,0
DIL16 = drill 0.813 long: 1 -8.89,-3.81; 2 -6.35,-3.81; 3 -3.81,-3.81; 4 -1.27,-3.81; 5 1.27,-3.81; 6 3.81,-3.81; 7 6.35,-3.81; 8 8.89,-3.81; 9 8.89,3.81; 10 6.35,3.81; 11 3.81,3.81; 12 1.27,3.81; 13 -1.27,3.81; 14 -3.81,3.81; 15 -6.35,3.81; 16 -8.89,3.81
1X03 = drill 1.016 pad 1.88: 1 0,0; 2 2.54,0; 3 5.08,0
1X08 = drill 1.016 pad 1.88: 1 0,0; 2 2.54,0; 3 5.08,0; 4 7.62,0; 5 10.16,0; 6 12.7,0; 7 15.24,0; 8 17.78,0
1X02 = drill 1.016 pad 1.88: 1 0,0; 2 2.54,0
1X04' = drill 1.016 long: 1 -3.81,0; 2 -1.27,0; 3 1.27,0; 4 3.81,0
1X10 = drill 1.016 long: 1 -11.43,0; 2 -8.89,0; 3 -6.35,0; 4 -3.81,0; 5 -1.27,0; 6 1.27,0; 7 3.81,0; 8 6.35,0; 9 8.89,0; 10 11.43,0
1X05' = drill 1.016 long: 1 -5.08,0; 2 -2.54,0; 3 0,0; 4 2.54,0; 5 5.08,0
1X02' = drill 1.016 long: 1 -1.27,0; 2 1.27,0
1X08' = drill 1.016 long: 1 -8.89,0; 2 -6.35,0; 3 -3.81,0; 4 -1.27,0; 5 1.27,0; 6 3.81,0; 7 6.35,0; 8 8.89,0
1X01 = drill 1.016 octagon: 1 0,0
LED3MM = drill 0.813 octagon: A -1.27,0; K 1.27,0
WIRELESS-NRF24L01-PA-EXT = drill 1 square: 1 -18.415,3.81 | drill 1: 2 -15.875,3.81; 3 -18.415,1.27; 4 -15.875,1.27; 5 -18.415,-1.27; 6 -15.875,-1.27; 7 -18.415,-3.81; 8 -15.875,-3.81
ARDUINO-NANO-3.0 = drill 1 square: J1.1 17.78,7.62 | drill 1: J1.2 15.24,7.62; J1.3 12.7,7.62; J1.4 10.16,7.62; J1.5 7.62,7.62; J1.6 5.08,7.62; J1.7 2.54,7.62; J1.8 0,7.62; J1.9 -2.54,7.62; J1.10 -5.08,7.62; J1.11 -7.62,7.62; J1.12 -10.16,7.62; J1.13 -12.7,7.62; J1.14 -15.24,7.62; J1.15 -17.78,7.62; J2.1 17.78,-7.62; J2.2 15.24,-7.62; J2.3 12.7,-7.62; J2.4 10.16,-7.62; J2.5 7.62,-7.62; J2.6 5.08,-7.62; J2.7 2.54,-7.62; J2.8 0,-7.62; J2.9 -2.54,-7.62; J2.10 -5.08,-7.62; J2.11 -7.62,-7.62; J2.12 -10.16,-7.62; J2.13 -12.7,-7.62; J2.14 -15.24,-7.62; J2.15 -17.78,-7.62 | hole 1.651: -20.32,7.62; -20.32,-7.62; 20.32,-7.62; 20.32,7.62
AXIAL-0.3 = drill 0.9 pad 1.88: P$1 -3.81,0; P$2 3.81,0
255SB = drill 1.118 long: 1 -3.81,0; 2 0,0; 3 3.81,0
MA04-1 = drill 1.016 long: 1 -3.81,0; 2 -1.27,0; 3 1.27,0; 4 3.81,0
PUSHBUTTON-AE = drill 0.8 pad 2.5 octagon: P$1 -3,0; P$2 -3,-6
AK500/2-H = drill 1.321 long: 1 -2.515,0; 2 2.515,0

### Placement (x,y rotation side)
B1  74.93,62.23 270 bottom
CYTRON1  39.37,85.09 270 top
CYTRON2  39.37,59.69 90 top
CYTRON3  159,105.16 270 top
CYTRON4  159,79.76 90 top
ENCODER1  39.37,38.1 270 top
ENCODER2  39.5,47.12 90 top
IC1  114.3,29.21 270 top
J1  21.59,57.15 270 top
J2  7.62,48.26 0 top
J3  14.86,17.65 0 top
J4  21.59,69.85 90 top
J5  7.62,40.64 0 top
J6  21.59,78.74 90 top
J7  21.72,61.98 90 top
J8  50.8,90.42 90 top
J9  7.62,33.02 0 top
JP1  [1X04']  80.14,2.67 0 top
JP2  64.77,7.62 0 top
JP3  [1X04']  87.63,7.62 0 top
JP4  [1X05']  7.62,101.6 180 top
JP5  [1X02']  104.14,21.59 90 top
JP6  [1X08']  103.89,52.07 90 top
JP7  41.91,17.78 0 top
LED1  135.89,21.59 90 top
LED2  135.89,31.75 90 top
LED3  135.89,41.91 90 top
LED4  135.89,11.43 90 top
LED5  135.89,55.88 90 top
M1  118.36,89.92 270 top
M2  143.76,89.92 270 top
PAIR  129.41,99.06 180 top
R1  121.67,97.66 180 top
R2  121.16,93.73 180 top
R3  132.08,38.1 0 top
R4  132.08,27.94 0 top
R5  132.08,17.78 0 top
R6  132.08,7.62 0 top
R7  39.88,43.43 180 top
R8  22.86,43.18 180 top
R9  132.08,52.07 0 top
R10  113.28,76.83 270 top
S1  111.76,49.53 270 top
SV3  30.48,39.37 270 top
TR  129.54,93.98 180 top
U$1  108.84,76.71 0 top
X1  151.13,41.91 90 top
X2  151.13,30.48 90 top
X3  151.13,19.05 90 top
X4  151.13,7.62 90 top
X5  151.13,53.34 90 top
X6  109.22,6.35 0 top
X7  160.53,69.34 90 top

### Tracks (layer width: path | path; a pad name or v marks a point on that pad's centre or on a via)
3.3V
  Bottom 1: M1.2 122.17,103.5 118.49,99.82 114.81,99.82 114.81,84.84 130.94,68.71 141.86,68.71 141.86,103.12 139.83,105.16 M2.J2.14
5V  (via drill 1.2)  (3 unrouted)
  Route14 1: v21.59,86.36 v11.43,86.36 | v29.72,46.35 20.95,46.35 v18.94,48.37 | v144.78,80.01 v139.46,80.01 | v156.45,66.8 v147.83,66.8
  Bottom 1: ENCODER1.1 39.5,38.23 | SV3.4 32.64,35.56 35.31,38.23 39.12,38.23 39.12,46.74 ENCODER2.1 38.99,46.61 29.97,46.61 v29.72,46.35 | B1.5V@1 B1.5V@2 49.28,13.72 44.58,13.72 | 44.58,13.72 14.73,13.72 14.73,17.53 J3.1 14.96,17.75 14.96,18.66 15.24,18.94 15.24,33.02 | J6.3 v21.59,86.36 | v11.43,86.36 11.43,55.88 15.24,52.07 | 15.24,52.07 J1.3 | 15.24,33.02 15.24,40.64 | 15.24,40.64 15.24,48.26 | 15.24,48.26 15.24,52.07 | v18.94,48.37 15.35,48.37 | 15.35,48.37 15.24,48.26 | 99.82,73.66 B1.5V@0 108.71,73.66 | 144.78,67.31 144.78,65.15 144.4,64.77 115.57,64.77 111.76,60.96 111.76,53.34 | 144.78,67.31 v144.78,80.01 | v139.46,80.01 139.2,79.76 M2.J2.4 | J2.3 12.81,48.37 15.35,48.37 | J5.3 15.24,40.64 | J9.3 15.24,33.02 | X7.1 156.24,66.83 156.21,66.8 v156.45,66.8 | v147.83,66.8 145.29,66.8 144.78,67.31 | S1.3 S1.2 108.71,49.53 108.71,73.66 | JP1.1 44.6,2.67 44.58,13.72 | R10.P$2 109.35,73.03 108.71,73.66
12V  (1 unrouted)
  Bottom 1: 157.48,39.37 157.45,39.4 X1.1 148.62,39.4 144.78,35.56 128.27,35.56 R3.P$1 | 157.48,39.37 157.48,27.94 | 157.48,27.94 151.15,27.94 X2.1 148.62,27.96 146.05,25.4 128.27,25.4 R4.P$1 | 151.13,15.24 128.27,15.24 R5.P$1 | 151.13,15.24 X3.1 | 157.48,27.94 157.48,15.24 | 157.48,15.24 151.13,15.24 | 157.48,15.24 157.48,5.08 157.45,5.11 X4.1 150.98,4.95 128.27,4.95 R6.P$1 117.98,7.62 117.98,6.35 X6.2 | 118.24,7.37 118.11,7.49 IC1.9 | R9.P$1 128.27,49.53 149.83,49.53 X5.1 157.48,50.83 157.48,39.37
23
  Bottom 1: JP2.1 B1.23
25
  Bottom 1: JP2.2 B1.25
47
  Bottom 1: JP3.1 B1.47
CE
  Bottom 1: M1.3 119.63,110.49 120.27,111.12 127.64,111.12 129.54,109.22 129.54,104.14 133.6,100.08 M2.J2.12
CSN
  Bottom 1: M2.J1.13 151.96,102.62 151.92,102.65 153.17,102.65 156.03,105.51 156.03,111.16 149.67,117.53 116.86,117.53 110.32,110.99 110.32,103.43 112.2,101.56 117.32,101.56 119.63,103.87 M1.4
DIR1A
  Bottom 1: B1.28 60.96,20.32 60.12,21.16 60.12,96.53 55.08,101.57 41.44,101.57 31.37,91.5 31.37,66.02 37.72,59.66 39.34,59.66 CYTRON2.1
DIR1AS
  Bottom 1: CYTRON4.1 156.46,79.76 153.92,82.3 M2.J1.5
DIR1B
  Bottom 1: B1.24 55.88,21.87 56.84,22.83 56.84,95.28 53.76,98.37 42.76,98.37 34.7,90.3 34.7,77.93 37.6,75.03 39.27,75.03 CYTRON1.5
DIR1BS
  Bottom 1: M2.J1.10 CYTRON3.5
DIR2A
  Bottom 1: CYTRON2.3 38.66,64.77 38.63,64.74 37.09,64.74 33.09,68.74 33.09,90.96 42.1,99.97 54.42,99.97 58.52,95.86 58.52,17.78 B1.26
DIR2AS
  Bottom 1: CYTRON4.3 157.23,84.84 154.69,87.38 M2.J1.7
DIR2B
  Bottom 1: CYTRON1.3 39.27,80.11 36.96,80.11 36.3,80.78 36.3,89.64 43.18,96.52 53.34,96.52 55.12,94.74 55.12,23.37 53.34,21.59 B1.22
DIR2BS
  Bottom 1: M2.J1.11 151.42,97.57 153.17,97.57 155.68,100.08 CYTRON3.3
E
  Bottom 1: B1.45 81.28,2.79 JP1.3
G_INT
  Bottom 1: B1.20 46.61,27.94 44.07,25.4 38.1,25.4 32.64,19.94 J3.8
GND  (via drill 1.2)  (4 unrouted)
  Route14 1: v26.67,38.1 v19.62,38.1 18.35,36.83 v11.43,36.83 | v147.18,74.93 v139.46,74.93 | v12.7,45.72 13.46,44.96 19.18,44.96 19.16,44.98 v18.94,44.98 | v24.13,74.93 34.29,74.93 v36.83,72.39 | v42.05,72.39 42.05,82.69 v44.45,85.09
  Bottom 1: CYTRON1.1 v44.45,85.09 49.64,85.09 49.79,85.24 50.7,85.24 B1.GND@4 | SV3.3 v26.67,38.1 26.67,33.02 27.94,31.75 31.75,31.75 35.56,35.56 ENCODER1.2 41.91,35.56 41.91,40.37 40.87,41.41 40.87,44.45 43.05,46.63 43.05,49.66 ENCODER2.2 | J6.1 J4.2 24.13,72.39 | 24.13,72.39 24.13,64.77 | 24.13,64.77 24.38,65.02 24.38,57.15 24.13,57.15 | 24.13,64.77 23.88,64.52 J7.2 | B1.GND@3 B1.GND@2 93.98,16.51 99.06,16.51 | 99.06,16.51 110.49,16.51 IC1.8 | 116.97,94.11 116.97,96.77 R1.P$2 120.52,97.66 125.73,102.87 125.73,106.68 123.95,108.46 122.3,108.46 M1.1 | 116.97,94.11 116.97,91.44 | 116.97,94.11 R2.P$2 116.97,93.34 116.97,85.72 128.02,74.68 M2.J2.2 139.2,74.68 v139.46,74.93 | CYTRON3.1 159.1,105.06 163.19,105.06 164.46,103.78 164.46,89.82 | 164.46,89.82 159.1,89.82 CYTRON4.5 | 154.05,79.63 153.92,79.76 M2.J1.4 148.34,79.76 147.32,78.74 147.32,74.93 v147.18,74.93 | 154.05,79.63 156.72,76.96 160.53,76.96 X7.2 | 164.46,89.82 164.46,80.52 160.91,76.96 | J1.1 24.13,57.15 | 24.13,57.15 24.13,50.16 19.05,45.09 R8.P$2 19.05,38.73 19.68,38.1 v19.62,38.1 | J3.3 19.94,38.1 | 154.05,59.69 154.05,79.63 | 106.68,1.52 99.06,1.52 99.06,6.35 | 106.68,1.52 161.29,1.52 161.29,59.69 154.05,59.69 | 99.06,16.51 99.06,6.35 | X6.1 106.68,6.35 106.68,1.52 | J9.1 7.62,36.83 | 7.62,36.83 J5.1 | J2.1 7.62,45.72 7.75,45.72 8.31,45.16 12.52,45.16 12.83,45.47 12.7,45.59 v12.7,45.72 | 7.62,36.83 v11.43,36.83 | B1.GND@0 B1.GND@1 99.16,68.48 105.41,68.48 | 105.41,68.48 106.81,68.48 106.81,41.15 117.73,41.15 117.73,56.39 121.03,59.69 154.05,59.69 | JP1.4 95.38,2.67 99.06,6.35 | v36.83,72.39 39.37,72.39 | 39.37,72.39 v42.05,72.39 41.83,72.39
  Bottom 1: 24.13,72.39 v24.13,74.93 | CYTRON2.5 39.37,72.39 | U$1.P$2 105.41,70.28 105.41,68.48
IN1
  Bottom 1: IC1.1 B1.A8
IN2
  Bottom 1: B1.A9 IC1.2
IN3
  Bottom 1: IC1.3 B1.A10
IN4
  Bottom 1: B1.A11 IC1.4
IN5
  Bottom 1: IC1.5 B1.A12
IN6
  Bottom 1: B1.A13 IC1.6
INT2
  Bottom 1: B1.2 43.18,53.34 41.91,52.07 40.53,52.07 40.51,52.1 39.6,52.1 ENCODER2.3
INT3
  Bottom 1: B1.3 40.64,55.88 ENCODER2.4
INT18
  Bottom 1: ENCODER1.4 41.91,30.48 44.45,33.02 B1.18
INT19
  Bottom 1: B1.19 44.45,30.48 41.91,27.94 36.83,27.94 36.83,33.02 ENCODER1.3
LDR_SIGNAL
  Bottom 1: B1.30 63.5,21.59 61.72,23.37 61.72,97.19 55.75,103.17 36.27,103.17 24.41,91.3 24.41,81.28 J6.2
LESAR
  Bottom 1: J7.1 18.39,61.98 17.3,63.07 17.3,88.72 34.95,106.37 57.07,106.37 64.92,98.52 64.92,26.52 68.58,22.86 B1.34
METAL
  Bottom 1: J4.1 21.44,69.7 19.69,69.7 19.02,70.36 19.02,88.18 35.61,104.77 56.41,104.77 63.32,97.85 63.32,25.58 66.04,22.86 B1.32
MISO
  Bottom 1: M1.7 114.33,108.55 114.33,110.47 118.18,114.33 135.37,114.33 137.93,111.76 148.59,111.76 149.04,111.31 149.04,109.27 150.61,107.7 M2.J1.15
MOSI
  Bottom 1: M1.6 117.09,104 116.25,103.16 112.98,103.16 112.05,104.09 112.05,110.45 117.52,115.92 149.01,115.92 153.73,111.21 153.73,111.2 154.43,110.49 154.43,106.17 153.42,105.16 M2.J1.14
N$3
  Bottom 1: LED5.A R9.P$2
N$5
  Bottom 1: PAIR.K 126.75,97.66 R1.P$1
N$7
  Bottom 1: TR.K 128.02,93.73 R2.P$1
N$8
  pour Bottom: 69.85,121.92 86.36,105.41 86.36,93.98 106.68,93.98 106.68,114.3 111.76,119.38 109.22,121.92
N$10
  Bottom 1: JP2.3 B1.27
N$11  (1 unrouted)
  Bottom 1: IC1.13 127.13,30.48 129.67,33.02 LED2.K 151.13,33.02
N$12
  Bottom 1: X1.2 149.88,43.18 LED3.K 127,43.18 124.46,40.64 124.46,33.02 IC1.14
N$15
  Bottom 1: X3.2 149.83,22.86 LED1.K 125.73,22.86 120.65,27.94 IC1.12
N$17
  Bottom 1: JP2.4 B1.29
N$18
  Bottom 1: B1.31 JP2.5
N$19
  Bottom 1: JP2.6 B1.33
N$20
  Bottom 1: JP2.7 B1.35
N$21
  Bottom 1: LED3.A R3.P$2
N$22  (1 unrouted)
N$23
  Bottom 1: B1.37 JP2.8
N$24  (1 unrouted)
N$27
  Bottom 1: JP2.9 B1.39
N$28
  Bottom 1: B1.41 JP2.10
N$29
  Bottom 1: JP3.2 B1.49
N$30
  Bottom 1: JP3.3 B1.51
N$31
  Bottom 1: LED4.A R6.P$2
N$32
  Bottom 1: B1.53 JP3.4
N$33
  Bottom 1: JP4.1 16.49,101.6 29.25,114.37 60.38,114.37 74.53,100.22 74.53,30.48 81.25,23.76 81.25,19.08 81.28,19.05 B1.44
N$34
  Bottom 1: JP4.2 10.19,101.63 10.19,103.23 22.93,115.97 61.05,115.97 76.12,100.89 76.12,31.14 83.79,23.48 83.79,17.81 B1.46
N$35
  Bottom 1: JP4.3 7.65,101.63 7.65,103.23 21.99,117.57 61.71,117.57 77.8,101.48 77.8,31.73 86.36,23.17 B1.48
N$36
  Bottom 1: B1.50 88.87,17.81 88.87,22.93 79.4,32.39 79.4,102.14 62.37,119.17 21.05,119.17 5.11,103.23 5.11,101.63 JP4.4
N$37
  Bottom 1: B1.52 91.41,17.81 91.41,22.65 81,33.06 81,102.8 63.03,120.77 20.11,120.77 2.57,103.23 2.57,101.63 JP4.5
N$38
  Bottom 1: JP6.7 B1.A1
N$39
  Bottom 1: B1.A2 JP6.6
N$40
  Bottom 1: JP6.5 B1.A3
N$41
  Bottom 1: B1.A4 JP6.4
N$42
  Bottom 1: B1.A5 99.06,48.23 99.09,48.26 JP6.3
N$43
  Bottom 1: JP6.2 B1.A6
N$44
  Bottom 1: B1.A7 JP6.1
N$45
  Bottom 1: B1.A0 JP6.8 104.14,60.96
N$46
  Bottom 1: B1.A14 JP5.2
N$47
  Bottom 1: JP5.1 B1.A15
N$48
  Bottom 1: JP7.1 49.53,25.4 B1.21
N$49
  pour Bottom: 3.81,25.4 3.81,3.81 41.91,3.81 41.91,10.16 11.27,10.16 11.27,25.4
N$50
  Bottom 1: R10.P$1 106.05,80.64 105.84,80.44 105.84,78.74 | 105.84,78.74 U$1.P$1 | B1.RESET 105.84,78.74
N$51
  pour Bottom: 95.25,78.74 90.17,78.74 90.17,39.37 87.63,36.83 87.63,31.75 91.44,27.94 95.25,27.94
O1
  Bottom 1: X5.2 149.83,57.15 LED5.K 122.3,57.15 122.3,35.56 IC1.15
O6
  Bottom 1: X4.2 148.56,12.7 LED4.K 124.46,12.7 123.19,13.97 123.19,21.59 119.38,25.4 IC1.11
PAIR
  Bottom 1: M2.J2.11 135.89,97.79 131.95,97.79 PAIR.A
PROX_SIGNAL
  Bottom 1: B1.36 71.12,22.86 67.21,26.77 67.21,98.49 57.73,107.97 34.28,107.97 15.57,89.25 15.57,59.72 20.58,54.71 21.49,54.71 J1.2
PWM1A
  Bottom 1: B1.9 46.1,72.64 46.1,69.6 42.16,65.66 42.16,62.61 41.78,62.23 CYTRON2.2
PWM1AS
  Bottom 1: M2.J1.6 154.71,84.84 157.15,82.4 158.9,82.4 CYTRON4.2
PWM1B
  Bottom 1: CYTRON1.4 49.64,77.47 49.79,77.62 50.06,77.62 50.16,77.72 B1.11
PWM1BS
  Bottom 1: M2.J1.9 162.56,92.46 162.56,97.64 159.1,97.64 CYTRON3.4
PWM2A
  Bottom 1: B1.10 44.7,75.18 44.45,74.93 44.45,70.79 40.97,67.31 CYTRON2.4
PWM2AS
  Bottom 1: M2.J1.8 154.69,89.92 157.23,87.38 CYTRON4.4
PWM2B
  Bottom 1: B1.12 45.47,80.26 43.18,82.55 CYTRON1.2
PWM2BS
  Bottom 1: M2.J1.12 153.42,100.08 155.96,102.62 CYTRON3.2
R3
  Bottom 1: B1.16 49.28,38.1 46.74,40.64 46.74,43.43 R7.P$1
RX  (via drill 1.2)
  Route14 1: v85.98,41.02 53.1,41.02 v52.72,40.64 | v110.49,87.63 v120.65,87.63
  Bottom 1: B1.15 v52.72,40.64 53.34,40.64 | v85.98,41.02 85.98,79.63 93.98,87.63 v110.49,87.63 | v120.65,87.63 120.9,87.38 M2.J2.7
RXB
  Bottom 1: R8.P$1 SV3.1 35.81,43.18 R7.P$2
SCK
  Bottom 1: M2.J2.15 131.39,107.7 131.14,107.95 131.14,109.88 128.3,112.72 119.61,112.72 117.09,110.21 M1.5 117.09,108.3
SCL  (via drill 1.2)
  Route14 1: v26.81,90.17 v43.18,90.17
  Bottom 1: J3.4 22.48,20.47 22.02,20.93 22.02,45.63 26.81,50.42 v26.81,90.17 | v43.18,90.17 49.64,90.17 49.79,90.32 50.7,90.32 J8.1
SDA  (via drill 1.2)
  Route14 1: v29.21,92.71 v43.18,92.71
  Bottom 1: v29.21,92.71 29.21,49.97 24,44.77 24,21.84 25.02,20.83 J3.5 | v43.18,92.71 49.64,92.71 49.79,92.86 50.7,92.86 J8.2
SIGNAL1
  Bottom 1: J2.2 10.16,51.08 9.03,52.21 9.03,87.35 31.24,109.57 58.4,109.57 69.16,98.81 69.16,28.63 73.66,24.13 B1.38
SIGNAL2
  Bottom 1: J5.2 10.16,43.43 6.1,43.43 5.08,44.45 5.08,85.67 30.58,111.17 59.06,111.17 71.02,99.2 71.02,29.31 76.2,24.13 B1.40
SIGNAL3
  Bottom 1: B1.42 78.74,24 72.92,29.82 72.92,99.56 59.72,112.77 29.92,112.77 3.48,86.33 3.48,29.54 5.08,27.94 10.16,27.94 J9.2
T
  Bottom 1: B1.43 78.74,2.79 JP1.2
TR
  Bottom 1: TR.A 131.83,95 M2.J2.10
TX  (via drill 1.2)
  Route14 1: v83.57,43.81 53.35,43.81 v52.72,43.18 | v110.49,90.17 v120.65,90.17
  Bottom 1: B1.14 v52.72,43.18 53.34,43.18 | v83.57,43.81 83.57,44.2 83.69,44.32 83.69,81.25 92.47,90.03 110.35,90.03 v110.49,90.17 | v120.65,90.17 120.9,90.17 121.16,89.92 M2.J2.8
TXB  (via drill 1.2)
  Route14 1: v36.83,40.64 v44.32,40.64
  Bottom 1: SV3.2 v36.83,40.64 | v44.32,40.64 44.45,40.64 49.15,35.94 49.15,35.43 50.67,35.43 B1.17